# Altium schematic sheet MCU.SchDoc
size A3; SheetNumber: 3; SheetTotal: 5
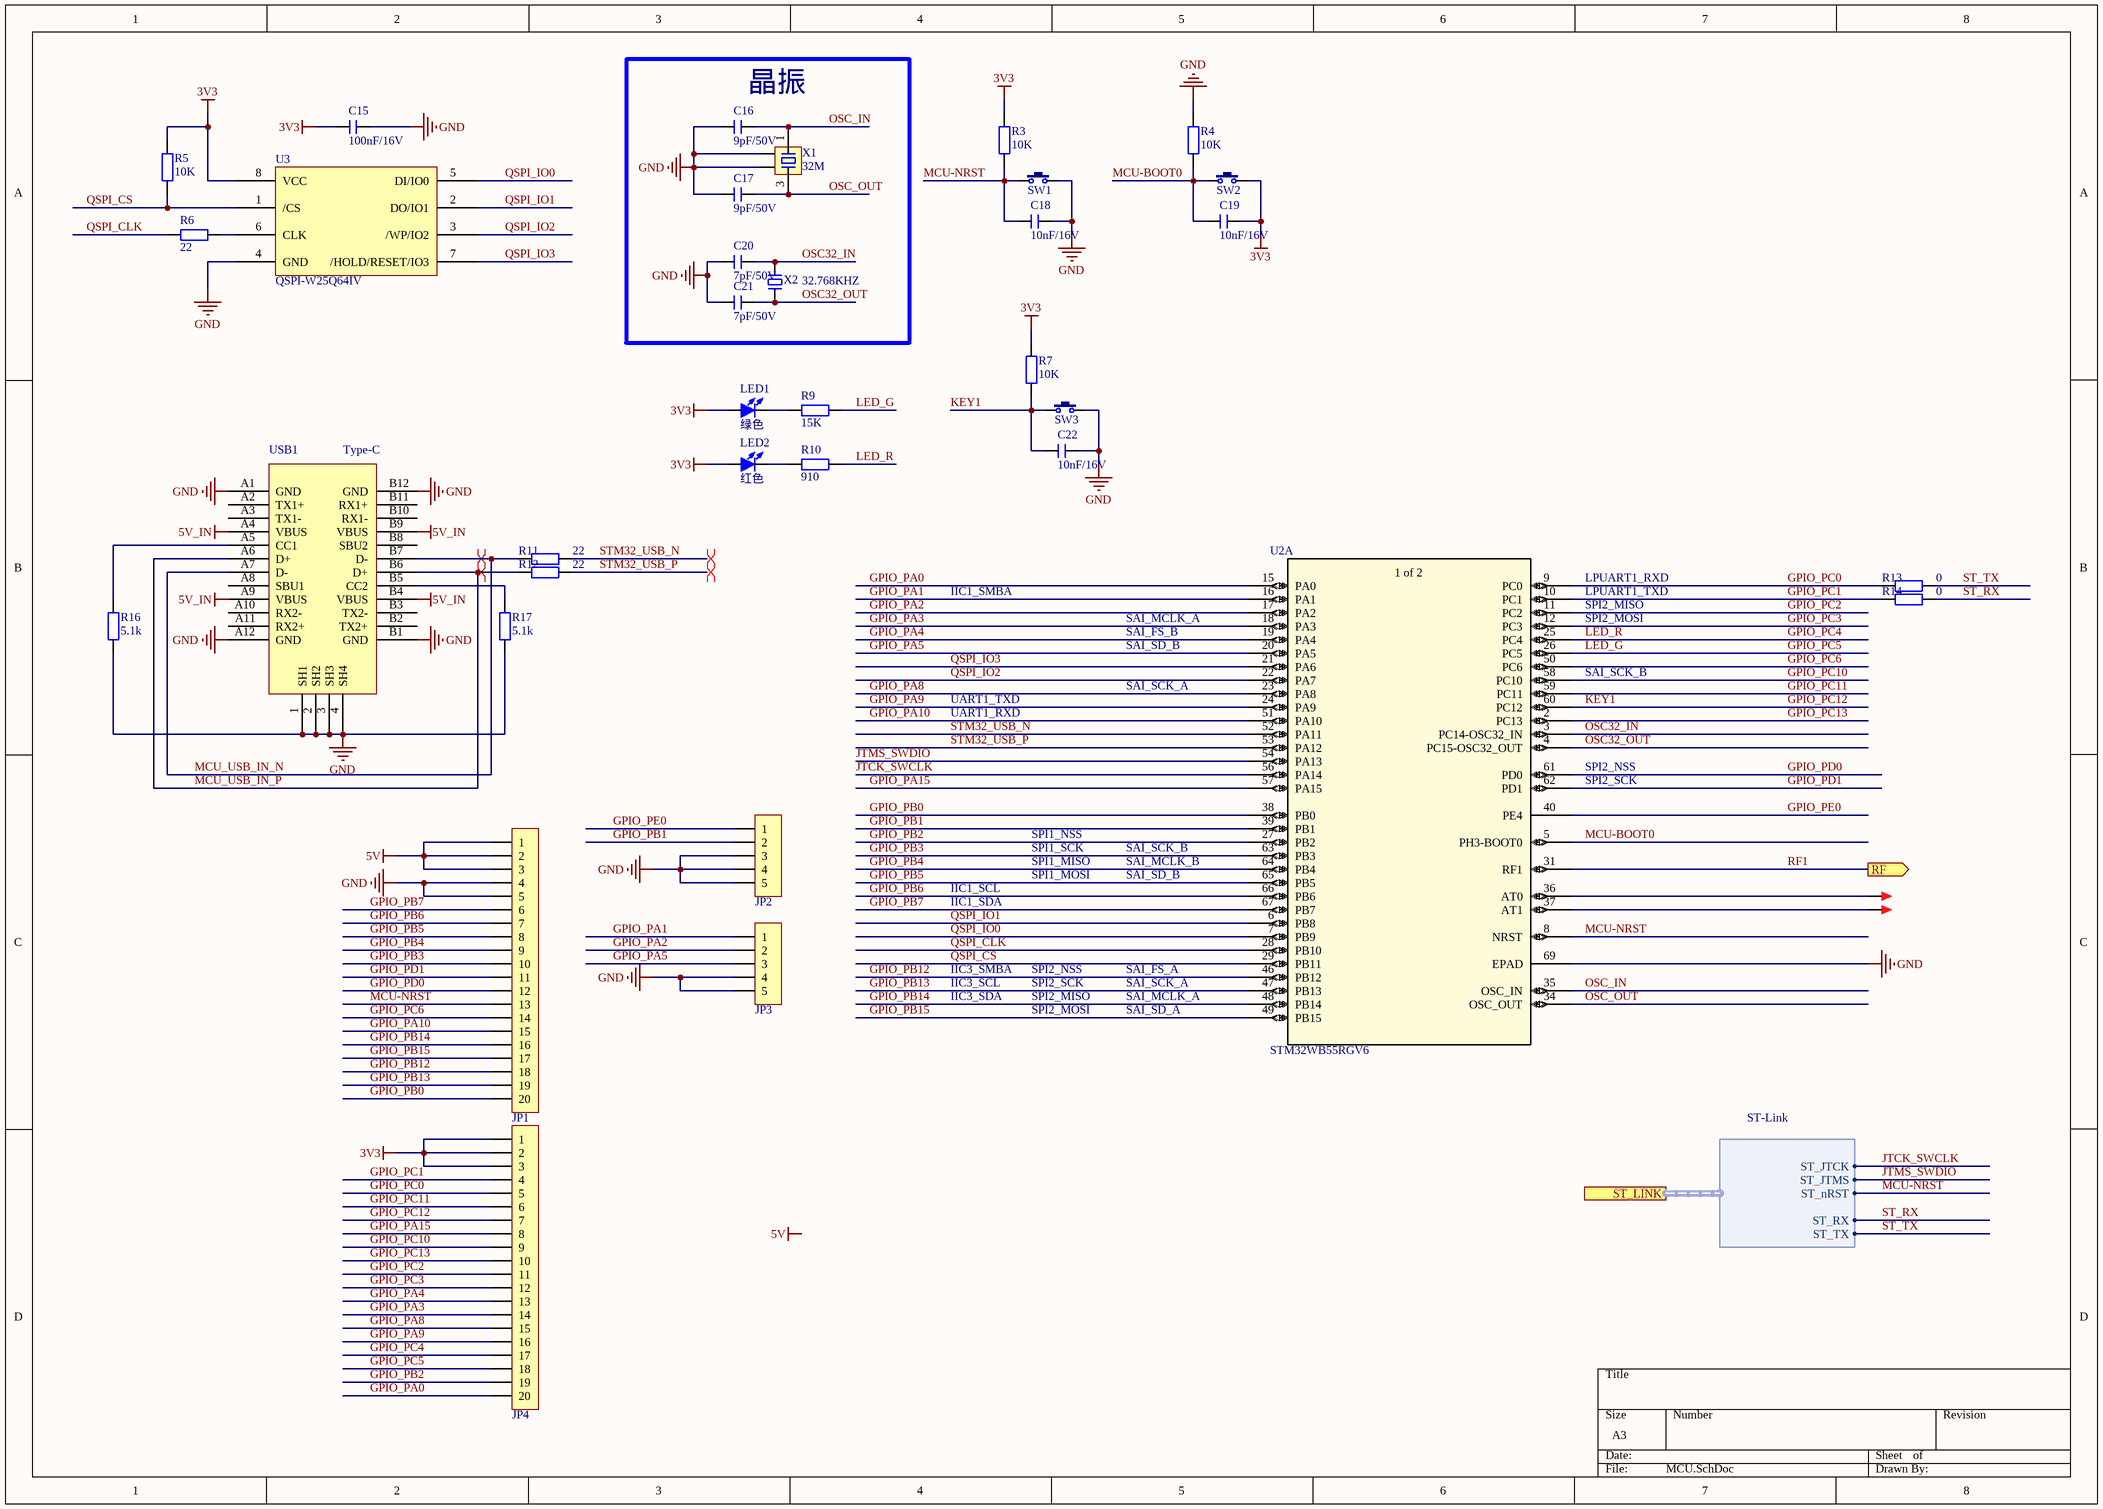
[diagram p0: MCU.SchDoc]

## Parts
C15  100nF/16V  [C 0402_L]
C16  9pF/50V  [C 0402_L]
C17  9pF/50V  [C 0402_L]
C18  10nF/16V  [C 0402_L]
C19  10nF/16V  [C 0402_L]
C20  7pF/50V  [C 0402_L]
C21  7pF/50V  [C 0402_L]
C22  10nF/16V  [C 0402_L]
JP1  HDR-1X20  [HDR2.54-LI-20P]  (value not drawn)
JP2  HDR-1X5  [HDR2.54-LI-5P]  (value not drawn)
JP3  HDR-1X5  [HDR2.54-LI-5P]  (value not drawn)
JP4  HDR-1X20  [HDR2.54-LI-20P]  (value not drawn)
LED1  绿色  [LED]
LED2  红色  [LED]
R3  10K  [R 0402_L]
R4  10K  [R 0402_L]
R5  10K  [R 0402_L]
R6  22  [R 0402_L]
R7  10K  [R 0402_L]
R9  15K  [R 0402_L]
R10  910  [R 0402_L]
R11  22  [R 0402_L]
R12  22  [R 0402_L]
R13  0  [R 0402_L]
R14  0  [R 0402_L]
R16  5.1k  [R 0402_L]
R17  5.1k  [R 0402_L]
SW1  3x6x5  [按钮]  (value not drawn)
SW2  3x6x5  [按钮]  (value not drawn)
SW3  3x6x5  [按钮]  (value not drawn)
TP1  TEST  [TEST 1.2]  (value not drawn)
TP2  TEST  [TEST 1.2]  (value not drawn)
U2  STM32WB55RGV6  [VFQFN68-8x8mm-M]  (part A of 2)
U3  QSPI-W25Q64IV  [QSPI]
USB1  Type-C  [Type-c接口]
X1  32M  [OSC 1612-4P]
X2  32.768KHZ  [OSC 3215-2P]

## Blocks framed on the sheet
晶振: C16 C17 C20 C21 X1 X2

## Ports
RF (out), ST_LINK (harness ST-Link)

## Harnesses
ST-Link: ST_JTCK, ST_JTMS, ST_nRST, ST_RX, ST_TX

## Nets
3V3: C15.2 C19.2 JP4.1 JP4.2 JP4.3 LED1.1(A) LED2.1(A) R3.2 R5.1 R7.2 SW2.2 U3.8(VCC)
5V: JP1.1 JP1.2 JP1.3
5V_IN: USB1.A4(VBUS) USB1.A9(VBUS) USB1.B4(VBUS) USB1.B9(VBUS)
GND: C15.1 C16.1 C17.1 C18.2 C20.1 C21.1 C22.2 JP1.4 JP1.5 JP2.3 JP2.4 JP2.5 JP3.4 JP3.5 R4.2 R16.2 R17.2 SW1.2 SW3.2 U2.69(EPAD) U3.4(GND) USB1.1(SH1) USB1.2(SH2) USB1.3(SH3) USB1.4(SH4) USB1.A1(GND) USB1.A12(GND) USB1.B1(GND) USB1.B12(GND) X1.2 X1.4
GPIO_PA0: JP4.20 U2.15(PA0)
GPIO_PA1: JP3.1 U2.16(PA1)
GPIO_PA2: JP3.2 U2.17(PA2)
GPIO_PA3: JP4.14 U2.18(PA3)
GPIO_PA4: JP4.13 U2.19(PA4)
GPIO_PA5: JP3.3 U2.20(PA5)
GPIO_PA8: JP4.15 U2.23(PA8)
GPIO_PA9: JP4.16 U2.24(PA9)
GPIO_PA10: JP1.15 U2.51(PA10)
GPIO_PA15: JP4.8 U2.57(PA15)
GPIO_PB0: JP1.20 U2.38(PB0)
GPIO_PB1: JP2.2 U2.39(PB1)
GPIO_PB2: JP4.19 U2.27(PB2)
GPIO_PB3: JP1.10 U2.63(PB3)
GPIO_PB4: JP1.9 U2.64(PB4)
GPIO_PB5: JP1.8 U2.65(PB5)
GPIO_PB6: JP1.7 U2.66(PB6)
GPIO_PB7: JP1.6 U2.67(PB7)
GPIO_PB12: JP1.18 U2.46(PB12)
GPIO_PB13: JP1.19 U2.47(PB13)
GPIO_PB14: JP1.16 U2.48(PB14)
GPIO_PB15: JP1.17 U2.49(PB15)
GPIO_PC0: JP4.5 R13.2 U2.9(PC0)
GPIO_PC1: JP4.4 R14.2 U2.10(PC1)
GPIO_PC2: JP4.11 U2.11(PC2)
GPIO_PC3: JP4.12 U2.12(PC3)
GPIO_PC4: JP4.17 R10.1 U2.25(PC4)  [also labelled LED_R]
GPIO_PC5: JP4.18 R9.1 U2.26(PC5)  [also labelled LED_G]
GPIO_PC6: JP1.14 U2.50(PC6)
GPIO_PC10: JP4.9 U2.58(PC10)
GPIO_PC11: JP4.6 U2.59(PC11)
GPIO_PC12: C22.1 JP4.7 R7.1 SW3.1 U2.60(PC12)  [also labelled KEY1]
GPIO_PC13: JP4.10 U2.2(PC13)
GPIO_PD0: JP1.12 U2.61(PD0)
GPIO_PD1: JP1.11 U2.62(PD1)
GPIO_PE0: JP2.1 U2.40(PE4)
JTCK_SWCLK: U2.56(PA14) ; port ST_LINK.ST_JTCK
JTMS_SWDIO: U2.54(PA13) ; port ST_LINK.ST_JTMS
MCU-BOOT0: C19.1 R4.1 SW2.1 U2.5(PH3-BOOT0)
MCU-NRST: C18.1 JP1.13 R3.1 SW1.1 U2.8(NRST) ; port ST_LINK.ST_nRST
MCU_USB_IN_N: R11.2 USB1.A7(D-) USB1.B7(D-)
MCU_USB_IN_P: R12.2 USB1.A6(D+) USB1.B6(D+)
OSC32_IN: C20.2 U2.3(PC14-OSC32_IN) X2.2
OSC32_OUT: C21.2 U2.4(PC15-OSC32_OUT) X2.1
OSC_IN: C16.2 U2.35(OSC_IN) X1.1
OSC_OUT: C17.2 U2.34(OSC_OUT) X1.3
QSPI_CLK: R6.1 U2.28(PB10)
QSPI_CS: R5.2 U2.29(PB11) U3.1(/CS)
QSPI_IO0: U2.7(PB9) U3.5(DI/IO0)
QSPI_IO1: U2.6(PB8) U3.2(DO/IO1)
QSPI_IO2: U2.22(PA7) U3.3(/WP/IO2)
QSPI_IO3: U2.21(PA6) U3.7(/HOLD/RESET/IO3)
RF1: U2.31(RF1) ; port RF
ST_RX: R14.1 ; port ST_LINK.ST_RX
ST_TX: R13.1 ; port ST_LINK.ST_TX
STM32_USB_N: R11.1 U2.52(PA11)
STM32_USB_P: R12.1 U2.53(PA12)
NetLED1_2: LED1.2(K) R9.2
NetLED2_2: LED2.2(K) R10.2
NetR6_2: R6.2 U3.6(CLK)
NetR16_1: R16.1 USB1.A5(CC1)
NetR17_1: R17.1 USB1.B5(CC2)
NetTP1_1: TP1.1 U2.36(AT0)
NetTP2_1: TP2.1 U2.37(AT1)

Not connected (* = marked no-connect by the designer): USB1 A2(TX1+) A3(TX1-) A8(SBU1) A10(RX2-) A11(RX2+) B2(TX2+) B3(TX2-) B8(SBU2) B10(RX1-) B11(RX1+)

## Layout directives
differential pair: MCU_USB_IN_N, MCU_USB_IN_P, STM32_USB_N, STM32_USB_P

## Notes on the sheet
- LPUART1_RXD
- IIC1_SMBA
- SAI_FS_B
- SAI_SD_B
- SAI_MCLK_A
- LPUART1_TXD
- SPI2_MISO
- SPI2_MOSI
- UART1_TXD
- UART1_RXD
- SAI_SCK_A
- SAI_SCK_B
- SPI2_NSS
- SPI2_SCK
- SPI1_NSS
- SPI1_SCK
- IIC1_SCL
- IIC1_SDA
- SPI1_MISO
- SPI1_MOSI
- SAI_MCLK_B
- IIC3_SMBA
- IIC3_SCL
- SAI_FS_A
- IIC3_SDA
- SAI_SD_A
- Labels drawn without touching a wire or pin: 5V
- (in symbol STM32WB55RGV6, part A) 1 of 2

## Library data of the parts
C15 = C: 贴片电容; 主类型: 电容; 值精度: ±10%; 元件封装: 0402; 具体类型: 陶瓷电容; 封装类型: 贴片; 温度漂移: X7R（15%）; 温度范围: -55°C ~ 125°C; 生产商: YAGEO(国巨); 生产商零件编码: CC0402KRX7R7BB104; 值/型号: 100nF/16V; 立创编号: C60474
C16 C17 = C: 贴片电容; 主类型: 电容; 值/型号: 10pF/50V; 值精度: ±1%; 元件封装: 0402; 具体类型: 陶瓷电容; 封装类型: 贴片; 温度漂移: C0G; 生产商: FH(风华); 生产商零件编码: 0402CG100F500NT; 立创编号: C285132
C18 C19 C22 = C: 贴片电容; 主类型: 电容; 值精度: ±10%; 元件封装: 0402; 具体类型: 陶瓷电容; 封装类型: 贴片; 温度漂移: X7R; 生产商: YAGEO(国巨); 生产商零件编码: CC0402KRX7R7BB103; 值/型号: 10nF/16V; 立创编号: C327009
C20 C21 = C: 贴片电容; 主类型: 电容; 值精度: ±0.25pF; 元件封装: 0402; 具体类型: 陶瓷电容; 封装类型: 贴片; 温度漂移: C0G; 生产商: FH(风华); 生产商零件编码: 0402CG7R0C500NT; 值/型号: 7pF/50V; 立创编号: C1577
JP1 JP4 = Header 20: 20P接插件
JP2 JP3 = Header 5: 5P接插件
LED1 LED2 = LED-SMD: C84267
R3 R4 R7 = R: 贴片电阻; 主类型: 电阻; 值精度: 1%; 元件封装: 贴片; 温度漂移: ±100ppm/℃; 生产商: YAGEO（国巨）; 生产商零件编码: RC0402FR-0710KL; 值/型号: 10K; 具体类型: 贴片电阻; 封装类型: 贴片; 立创编号: C60490
R5 = R: 贴片电阻 0402 1%; 主类型: 电阻; 元件封装: 0402; 封装类型: 贴片; 温度漂移: ±100ppm/℃; 生产商: 国巨; 生产商零件编码: RC0402FR-0710KL; 值/型号: 10K; 值精度: ±1%; 具体类型: 贴片电阻; 立创编号: C60490
R6 = R: 贴片电阻 0402 1%; 主类型: 电阻; 元件封装: 0402; 封装类型: 贴片; 温度漂移: ±100ppm/℃; 生产商: 国巨; 生产商零件编码: RC0402FR-0722RL; 值/型号: 22; 值精度: ±1%; 具体类型: 贴片电阻; 立创编号: C114765
R9 = R: 贴片电阻 0402 5%; 主类型: 电阻; 值精度: ±1%; 元件封装: 0402; 封装类型: 贴片; 温度漂移: 50ppm; 生产商: 国巨; 生产商零件编码: RT0402FRE0715KL; 值/型号: 15K; 具体类型: 贴片电阻; 立创编号: C136975
R10 = R: 贴片电阻 0402 5%; 主类型: 电阻; 值精度: ±1%; 元件封装: 0402; 封装类型: 贴片; 温度漂移: 50ppm; 生产商: UNI-ROYAL(厚声); 生产商零件编码: 0402WGF9100TCE; 值/型号: 910; 具体类型: 贴片电阻; 立创编号: C44933
R11 R12 = R: 贴片电阻 0402 5%; 主类型: 电阻; 值精度: ±1%; 元件封装: 0402; 封装类型: 贴片; 温度漂移: 50ppm; 生产商: 国巨; 生产商零件编码: RC0402FR-0722RL; 值/型号: 22; 具体类型: 贴片电阻; 立创编号: C114765
R13 R14 = R: 贴片电阻 0402 5%; 主类型: 电阻; 元件封装: 0402; 封装类型: 贴片; 温度漂移: 50ppm; 生产商: 国巨; 生产商零件编码: RC0402JR-070RL; 值/型号: 0; 值精度: ±5%; 具体类型: 贴片电阻; 立创编号: C60485
R16 R17 = R: 贴片电阻 0402 5%; 主类型: 电阻; 值精度: ±1%; 元件封装: 0402; 封装类型: 贴片; 温度漂移: 50ppm; 生产商: 国巨; 生产商零件编码: RC0402FR-075K1L; 值/型号: 5.1K; 具体类型: 贴片电阻; 立创编号: C105872
SW1-SW3 = TSW 3x6: 3x6轻触开关
TP1 TP2 = TEST: 测试点
U2 = STM32WB55RGV6: No Description Available; Vendor: STMicroelectronics; Built_By: EMA_UL_Team; SourceLibrary: Updates_to_database_2020-10-19; Manufacturer_Part_Number: STM32WB55RGV6; Copyright: Copyright (C) 2018 Accelerated Designs. All rights reserved; RefDes: RefDes; Type: DEV
U3 = QSPI-W25Q256IV
USB1 = USB-Type-C-TOP
X1 = XTAL-4P: 4脚无源晶振; 主类型: 晶振; 值精度: 9PPM; 元件封装: 1612; 具体类型: 无源晶振; 封装类型: 贴片; 温度范围: -40℃~85℃; 生产商: EPSON(爱普生); 生产商零件编码: X1E0002510050; 值/型号: 32M; 立创编号: C255987
X2 = XTAL-2P: 2脚无源脚晶振; 主类型: 晶振; 值精度: 10PPM; 元件封装: 3215; 具体类型: 无源晶振; 封装类型: 贴片; 温度范围: -40℃ ~ +85℃; 生产商: EPSON(爱普生); 生产商零件编码: Q13FC1350000200; 值/型号: 32.768K; 立创编号: C48615